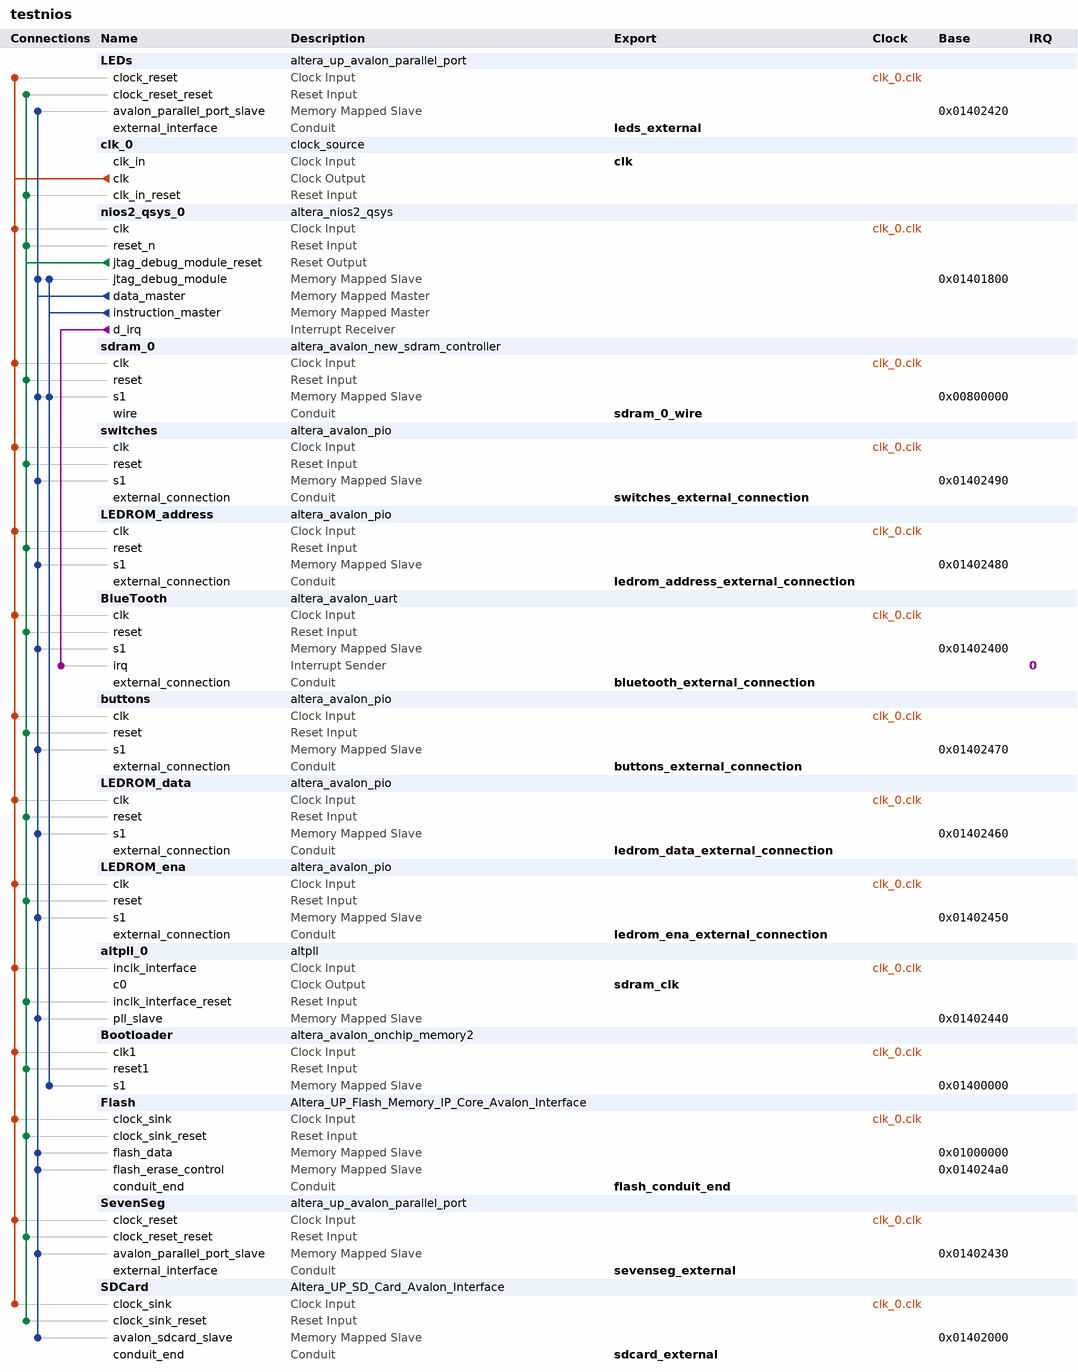
[diagram p0: system contents]
# Platform Designer (Qsys) system testnios, Cyclone III EP3C16F484C6
# Parameters at their usual value, and those the tool derives, are not listed.
package require -exact qsys 12.1
create_system testnios
set_project_property DEVICE_FAMILY {Cyclone III}
set_project_property DEVICE EP3C16F484C6

add_instance LEDs altera_up_avalon_parallel_port 12.0
set_instance_parameter_value LEDs board DE0
set_instance_parameter_value LEDs preset LEDs
set_instance_parameter_value LEDs capture false
set_instance_parameter_value LEDs edge Rising
set_instance_parameter_value LEDs irq false

add_instance clk_0 clock_source 12.1
set_instance_parameter_value clk_0 clockFrequency 50000000

add_instance nios2_qsys_0 altera_nios2_qsys 12.1
set_instance_parameter_value nios2_qsys_0 resetSlave Bootloader.s1
set_instance_parameter_value nios2_qsys_0 exceptionSlave sdram_0.s1
set_instance_parameter_value nios2_qsys_0 breakSlave nios2_qsys_0.jtag_debug_module
set_instance_parameter_value nios2_qsys_0 muldiv_multiplierType NoneSmall
set_instance_parameter_value nios2_qsys_0 impl Small
set_instance_parameter_value nios2_qsys_0 icache_size 4096

add_instance sdram_0 altera_avalon_new_sdram_controller 12.1
set_instance_parameter_value sdram_0 TAC 5.5
set_instance_parameter_value sdram_0 TRCD 20.0
set_instance_parameter_value sdram_0 TRP 20.0
set_instance_parameter_value sdram_0 casLatency 3
set_instance_parameter_value sdram_0 columnWidth 8
set_instance_parameter_value sdram_0 dataWidth 16
set_instance_parameter_value sdram_0 generateSimulationModel false
set_instance_parameter_value sdram_0 model custom
set_instance_parameter_value sdram_0 numberOfBanks 4
set_instance_parameter_value sdram_0 numberOfChipSelects 1
set_instance_parameter_value sdram_0 powerUpDelay 100.0
set_instance_parameter_value sdram_0 refreshPeriod 15.625
set_instance_parameter_value sdram_0 rowWidth 12

add_instance switches altera_avalon_pio 12.1
set_instance_parameter_value switches direction Input
set_instance_parameter_value switches width 10

add_instance LEDROM_address altera_avalon_pio 12.1
set_instance_parameter_value LEDROM_address direction Output
set_instance_parameter_value LEDROM_address width 9

add_instance BlueTooth altera_avalon_uart 12.1
set_instance_parameter_value BlueTooth baud 115200
set_instance_parameter_value BlueTooth dataBits 8
set_instance_parameter_value BlueTooth fixedBaud true
set_instance_parameter_value BlueTooth parity NONE
set_instance_parameter_value BlueTooth stopBits 1

add_instance buttons altera_avalon_pio 12.1
set_instance_parameter_value buttons direction Input
set_instance_parameter_value buttons edgeType ANY
set_instance_parameter_value buttons width 3

add_instance LEDROM_data altera_avalon_pio 12.1
set_instance_parameter_value LEDROM_data direction Output
set_instance_parameter_value LEDROM_data width 16

add_instance LEDROM_ena altera_avalon_pio 12.1
set_instance_parameter_value LEDROM_ena direction Output
set_instance_parameter_value LEDROM_ena width 1

add_instance altpll_0 altpll 12.1
set_instance_parameter_value altpll_0 INCLK0_INPUT_FREQUENCY 20000
set_instance_parameter_value altpll_0 CLK0_MULTIPLY_BY 1
set_instance_parameter_value altpll_0 CLK0_DIVIDE_BY 1
set_instance_parameter_value altpll_0 CLK0_PHASE_SHIFT -3000
set_instance_parameter_value altpll_0 PORT_clk1 PORT_UNUSED
set_instance_parameter_value altpll_0 PORT_clk2 PORT_UNUSED
set_instance_parameter_value altpll_0 PORT_clk3 PORT_UNUSED
set_instance_parameter_value altpll_0 PORT_ARESET PORT_UNUSED
set_instance_parameter_value altpll_0 PORT_LOCKED PORT_UNUSED

add_instance Bootloader altera_avalon_onchip_memory2 12.1
set_instance_parameter_value Bootloader dataWidth 32
set_instance_parameter_value Bootloader dualPort false
set_instance_parameter_value Bootloader initMemContent true
set_instance_parameter_value Bootloader initializationFileName Bootloader
set_instance_parameter_value Bootloader memorySize 4096
set_instance_parameter_value Bootloader useNonDefaultInitFile true
set_instance_parameter_value Bootloader writable false

add_instance Flash Altera_UP_Flash_Memory_IP_Core_Avalon_Interface 1.0
set_instance_parameter_value Flash FLASH_MEMORY_ADDRESS_WIDTH 22

add_instance SevenSeg altera_up_avalon_parallel_port 12.0
set_instance_parameter_value SevenSeg board DE0
set_instance_parameter_value SevenSeg preset {Seven Segment Displays}
set_instance_parameter_value SevenSeg capture false
set_instance_parameter_value SevenSeg edge Rising
set_instance_parameter_value SevenSeg irq false

add_instance SDCard Altera_UP_SD_Card_Avalon_Interface 1.0

# connections
add_connection clk_0.clk altpll_0.inclk_interface clock
add_connection clk_0.clk BlueTooth.clk clock
add_connection clk_0.clk Bootloader.clk1 clock
add_connection clk_0.clk buttons.clk clock
add_connection clk_0.clk Flash.clock_sink clock
add_connection clk_0.clk LEDROM_address.clk clock
add_connection clk_0.clk LEDROM_data.clk clock
add_connection clk_0.clk LEDROM_ena.clk clock
add_connection clk_0.clk LEDs.clock_reset clock
add_connection clk_0.clk nios2_qsys_0.clk clock
add_connection clk_0.clk SDCard.clock_sink clock
add_connection clk_0.clk sdram_0.clk clock
add_connection clk_0.clk SevenSeg.clock_reset clock
add_connection clk_0.clk switches.clk clock
add_connection nios2_qsys_0.jtag_debug_module_reset altpll_0.inclk_interface_reset reset
add_connection nios2_qsys_0.jtag_debug_module_reset BlueTooth.reset reset
add_connection nios2_qsys_0.jtag_debug_module_reset Bootloader.reset1 reset
add_connection nios2_qsys_0.jtag_debug_module_reset buttons.reset reset
add_connection nios2_qsys_0.jtag_debug_module_reset clk_0.clk_in_reset reset
add_connection nios2_qsys_0.jtag_debug_module_reset Flash.clock_sink_reset reset
add_connection nios2_qsys_0.jtag_debug_module_reset LEDROM_address.reset reset
add_connection nios2_qsys_0.jtag_debug_module_reset LEDROM_data.reset reset
add_connection nios2_qsys_0.jtag_debug_module_reset LEDROM_ena.reset reset
add_connection nios2_qsys_0.jtag_debug_module_reset LEDs.clock_reset_reset reset
add_connection nios2_qsys_0.jtag_debug_module_reset nios2_qsys_0.reset_n reset
add_connection nios2_qsys_0.jtag_debug_module_reset SDCard.clock_sink_reset reset
add_connection nios2_qsys_0.jtag_debug_module_reset sdram_0.reset reset
add_connection nios2_qsys_0.jtag_debug_module_reset SevenSeg.clock_reset_reset reset
add_connection nios2_qsys_0.jtag_debug_module_reset switches.reset reset
add_connection nios2_qsys_0.data_master altpll_0.pll_slave avalon
set_connection_parameter_value nios2_qsys_0.data_master/altpll_0.pll_slave baseAddress 0x01402440
add_connection nios2_qsys_0.data_master BlueTooth.s1 avalon
set_connection_parameter_value nios2_qsys_0.data_master/BlueTooth.s1 baseAddress 0x01402400
add_connection nios2_qsys_0.data_master buttons.s1 avalon
set_connection_parameter_value nios2_qsys_0.data_master/buttons.s1 baseAddress 0x01402470
add_connection nios2_qsys_0.data_master Flash.flash_data avalon
set_connection_parameter_value nios2_qsys_0.data_master/Flash.flash_data baseAddress 0x01000000
add_connection nios2_qsys_0.data_master Flash.flash_erase_control avalon
set_connection_parameter_value nios2_qsys_0.data_master/Flash.flash_erase_control baseAddress 0x014024a0
add_connection nios2_qsys_0.data_master LEDROM_address.s1 avalon
set_connection_parameter_value nios2_qsys_0.data_master/LEDROM_address.s1 baseAddress 0x01402480
add_connection nios2_qsys_0.data_master LEDROM_data.s1 avalon
set_connection_parameter_value nios2_qsys_0.data_master/LEDROM_data.s1 baseAddress 0x01402460
add_connection nios2_qsys_0.data_master LEDROM_ena.s1 avalon
set_connection_parameter_value nios2_qsys_0.data_master/LEDROM_ena.s1 baseAddress 0x01402450
add_connection nios2_qsys_0.data_master LEDs.avalon_parallel_port_slave avalon
set_connection_parameter_value nios2_qsys_0.data_master/LEDs.avalon_parallel_port_slave baseAddress 0x01402420
add_connection nios2_qsys_0.data_master nios2_qsys_0.jtag_debug_module avalon
set_connection_parameter_value nios2_qsys_0.data_master/nios2_qsys_0.jtag_debug_module baseAddress 0x01401800
add_connection nios2_qsys_0.data_master SDCard.avalon_sdcard_slave avalon
set_connection_parameter_value nios2_qsys_0.data_master/SDCard.avalon_sdcard_slave baseAddress 0x01402000
add_connection nios2_qsys_0.data_master sdram_0.s1 avalon
set_connection_parameter_value nios2_qsys_0.data_master/sdram_0.s1 baseAddress 0x00800000
add_connection nios2_qsys_0.data_master SevenSeg.avalon_parallel_port_slave avalon
set_connection_parameter_value nios2_qsys_0.data_master/SevenSeg.avalon_parallel_port_slave baseAddress 0x01402430
add_connection nios2_qsys_0.data_master switches.s1 avalon
set_connection_parameter_value nios2_qsys_0.data_master/switches.s1 baseAddress 0x01402490
add_connection nios2_qsys_0.instruction_master Bootloader.s1 avalon
set_connection_parameter_value nios2_qsys_0.instruction_master/Bootloader.s1 baseAddress 0x01400000
add_connection nios2_qsys_0.instruction_master nios2_qsys_0.jtag_debug_module avalon
set_connection_parameter_value nios2_qsys_0.instruction_master/nios2_qsys_0.jtag_debug_module baseAddress 0x01401800
add_connection nios2_qsys_0.instruction_master sdram_0.s1 avalon
set_connection_parameter_value nios2_qsys_0.instruction_master/sdram_0.s1 baseAddress 0x00800000
add_connection nios2_qsys_0.d_irq BlueTooth.irq interrupt
set_connection_parameter_value nios2_qsys_0.d_irq/BlueTooth.irq irqNumber 0

# exported interfaces
add_interface clk clock sink
set_interface_property clk EXPORT_OF clk_0.clk_in
add_interface sdram_0_wire conduit end
set_interface_property sdram_0_wire EXPORT_OF sdram_0.wire
add_interface switches_external_connection conduit end
set_interface_property switches_external_connection EXPORT_OF switches.external_connection
add_interface ledrom_address_external_connection conduit end
set_interface_property ledrom_address_external_connection EXPORT_OF LEDROM_address.external_connection
add_interface bluetooth_external_connection conduit end
set_interface_property bluetooth_external_connection EXPORT_OF BlueTooth.external_connection
add_interface ledrom_data_external_connection conduit end
set_interface_property ledrom_data_external_connection EXPORT_OF LEDROM_data.external_connection
add_interface buttons_external_connection conduit end
set_interface_property buttons_external_connection EXPORT_OF buttons.external_connection
add_interface ledrom_ena_external_connection conduit end
set_interface_property ledrom_ena_external_connection EXPORT_OF LEDROM_ena.external_connection
add_interface sdram_clk clock source
set_interface_property sdram_clk EXPORT_OF altpll_0.c0
add_interface flash_conduit_end conduit end
set_interface_property flash_conduit_end EXPORT_OF Flash.conduit_end
add_interface leds_external conduit end
set_interface_property leds_external EXPORT_OF LEDs.external_interface
add_interface sdcard_external conduit end
set_interface_property sdcard_external EXPORT_OF SDCard.conduit_end
add_interface sevenseg_external conduit end
set_interface_property sevenseg_external EXPORT_OF SevenSeg.external_interface

save_system testnios.qsys
